# EAGLE design IUWASH_PIPE_BATTERY (EAGLE 6.5.0)
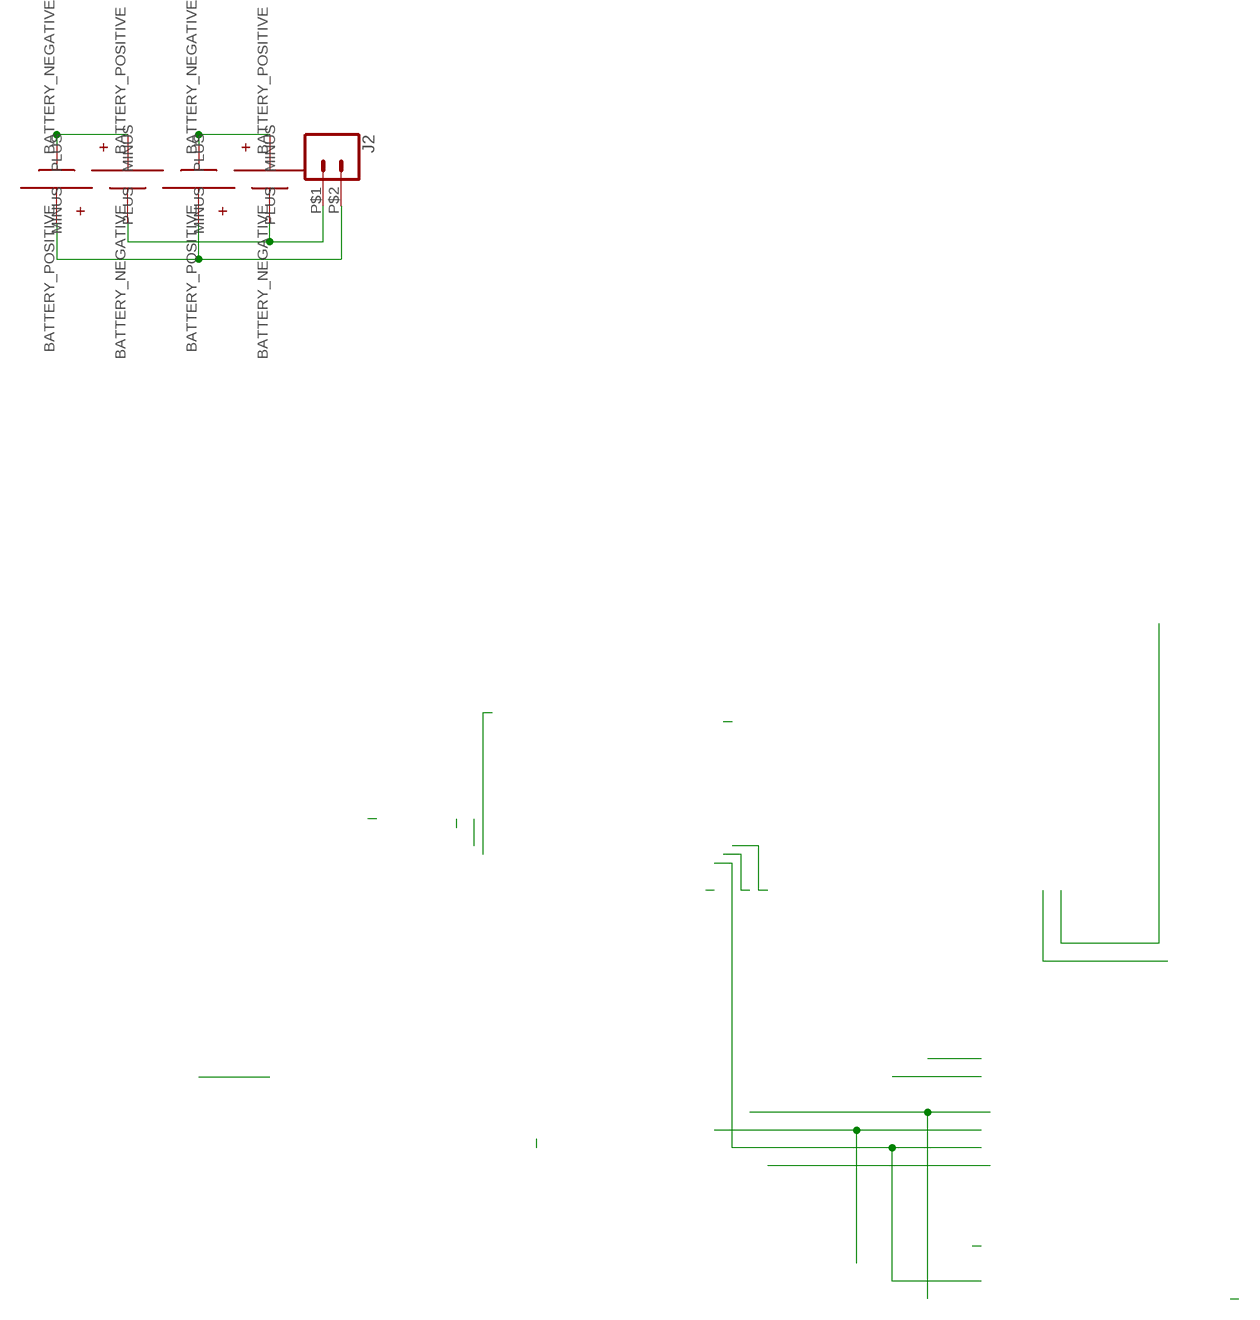
[diagram p0: schematic, sheet 1]

## Parts
J2  CONN_02PTH2  [1X02_BIG]
U$4  SMT18650  [18650SMT]
U$5  SMT18650  [18650SMT]
U$6  SMT18650  [18650SMT]
U$7  SMT18650  [18650SMT]

## Nets
N$1: J2.P$1 U$5.BATTERY_NEGATIVE(MINUS) U$7.BATTERY_NEGATIVE(MINUS)
N$9: J2.P$2 U$4.BATTERY_POSITIVE(PLUS) U$6.BATTERY_POSITIVE(PLUS)
N$10: U$4.BATTERY_NEGATIVE(MINUS) U$5.BATTERY_POSITIVE(PLUS)
N$11: U$6.BATTERY_NEGATIVE(MINUS) U$7.BATTERY_POSITIVE(PLUS)

## Library data of the parts
J2 = SparkFun-Connectors:CONN_02: Multi connection point. Often used as Generic Header-pin footprint for 0.1 inch spaced/style header connections On any of the 0.1 inch spaced packages, you can populate with these: Break Away Headers - Straight <https://www.sparkfun.com/products/116> (PRT-00116) Break Away Male Headers - Right Angle <https://www.sparkfun.com/products/553> (PRT-00553) Female Headers <https://www.sparkfun.com/products/115> (PRT-00115) Break Away Headers - Machine Pin <https://www.sparkfun.com/products/117> (PRT-00117) Break Away Female Headers - Swiss Machine Pin <https://www.sparkfun.com/products/743> (PRT-00743) For SCREWTERMINALS and SPRING TERMINALS visit here: Screw Terimnals on SparkFun.com <https://www.sparkfun.com/search/results?term=Screw+Terminals> (5mm/3.5mm/2.54mm spacing) This device is also useful as a general connection point to wire up your design to another part of your project. Our various solder wires solder well into these plated through hole pads. Hook-Up Wire - Assortment (Stranded, 22 AWG) <https://www.sparkfun.com/products/11375> (PRT-11375) Hook-Up Wire - Assortment (Solid Core, 22 AWG) <https://www.sparkfun.com/products/11367> (PRT-11367) View the entire wire category on our website here <https://www.sparkfun.com/categories/141> Special notes: Molex polarized connector foot print use with: PRT-08233 with associated crimp pins and housings. 2.54_SCREWTERM for use with PRT-10571. 3.5mm Screw Terminal footprints for PRT-08084 5mm Screw Terminal footprints for use with PRT-08432
U$4-U$7 = SMT18650:SMT18650

## Board
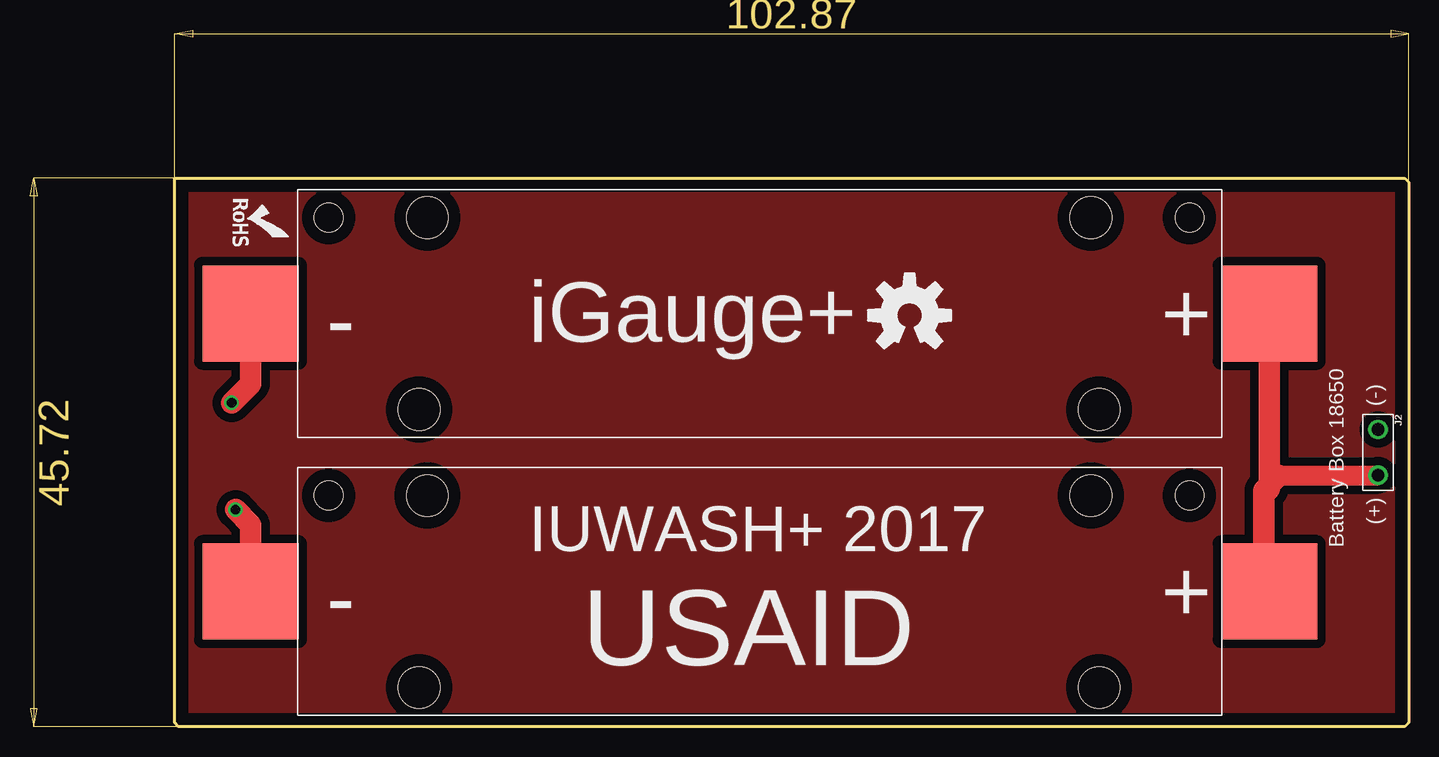
[diagram p1: board, top side]
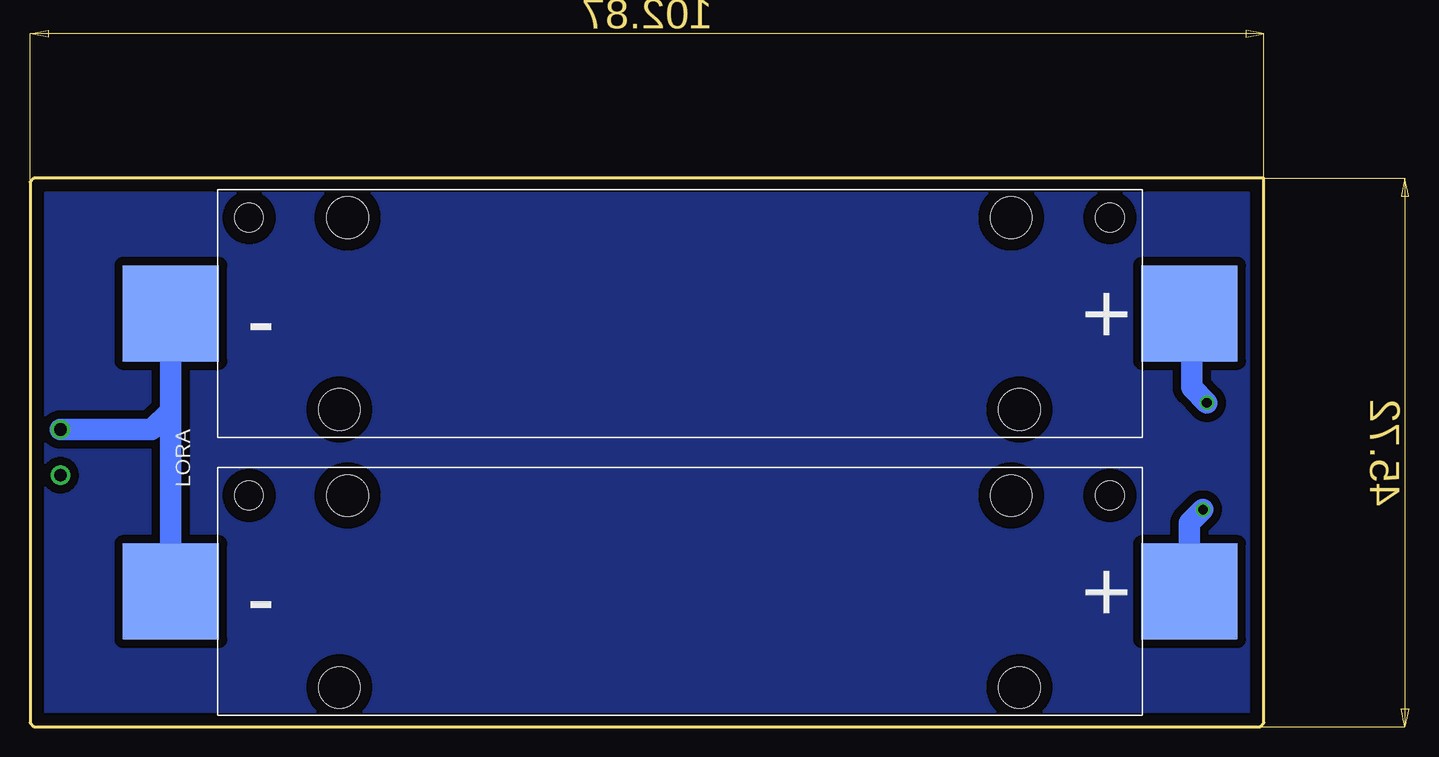
[diagram p2: board, bottom side, seen from below]

Size 102.87 x 45.72 mm. Coordinates in mm from the lower left corner, seen from the top.
Outline: 102.55,45.72 102.87,45.4 102.87,0.32 102.55,0 0.32,0 0,0.32 0,45.72 102.55,45.72
Copper layers (1*16): Top 0.035mm / dielectric 1.5mm / Bottom 0.035mm
Design rules "default *": minimum track width 10mil, minimum drill 24mil, track to track 28mil, track to pad 28mil, pad to pad 28mil, via to via 28mil, smd to smd 28mil, copper to edge 40mil, drill to drill 8mil, minimum pad ring 10mil, minimum via ring 8mil, stop-mask expansion 4mil, vias tented up to drill 0mil, thermal gap 10mil

### Footprints (pad centres in the part's own frame; a part is rotated, then mirrored left to right if it is on the bottom)
1X02_BIG = drill 1.067: P$1 0,0; P$2 3.81,0
18650SMT = smd 8 x 8: BATTERY_NEGATIVE 80.98,10.32; BATTERY_POSITIVE -3.95,10.32 | hole 3.45: 66.925,18.325; 10.925,2.325 | hole 2.39: 74.455,2.325

### Placement (x,y rotation side)
J2  100.33,24.77 270 top
U$1  [OSHW-LOGO-L]  61.28,34.29 0 top
U$4  87.31,21.59 180 top
U$5  10.16,21.59 180 bottom
U$6  87.31,44.77 180 top
U$7  10.16,44.77 180 bottom
U$12  [ROHS_LOGO_0.18_IN]  4.76,44.13 270 top

### Tracks (layer width: path | path; a pad name or v marks a point on that pad's centre or on a via)
N$1
  Bottom 1.778: J2.P$1 92.71,24.77 91.14,26.33 | U$7.BATTERY_NEGATIVE 91.12,34.43 91.12,26.35 91.14,26.33 | U$5.BATTERY_NEGATIVE 91.14,26.33
N$9
  Top 1.676: 92.08,20.95 J2.P$2
  Top 1.778: 92.08,20.95 90.81,19.69 90.81,19.37 | 90.81,19.37 90.81,11.73 U$4.BATTERY_POSITIVE | U$6.BATTERY_POSITIVE 91.26,19.83 90.81,19.37
N$10  (via drill 0.8)
  Top 1.778: v5.08,18.1 6.35,16.83 6.35,11.29 U$4.BATTERY_NEGATIVE
  Bottom 1.778: U$5.BATTERY_POSITIVE 6.21,16.97 v5.08,18.1
N$11  (via drill 0.8)
  Top 1.778: U$6.BATTERY_NEGATIVE 6.33,28.56 v4.76,26.99
  Bottom 1.778: v4.76,26.99 6.03,28.26 6.03,34.27 U$7.BATTERY_POSITIVE
N$25
  pour Top: 0.32,0.63 0.64,0.32 102.24,0.32 102.55,0.63 102.55,45.08 102.24,45.4 0.64,45.4 0.32,45.08
N$26
  pour Bottom: 0.32,45.08 0.64,45.4 102.24,45.4 102.55,45.08 102.55,0.63 102.24,0.32 0.64,0.32 0.32,0.63

### Text on the board
tNames: iGauge+ | Battery Box 18650 | (-) | (+) | IUWASH+ 2017 | USAID
bNames: GPS | LORA | 18650 Battery | USAID